# Altium project PCB.PrjPcb
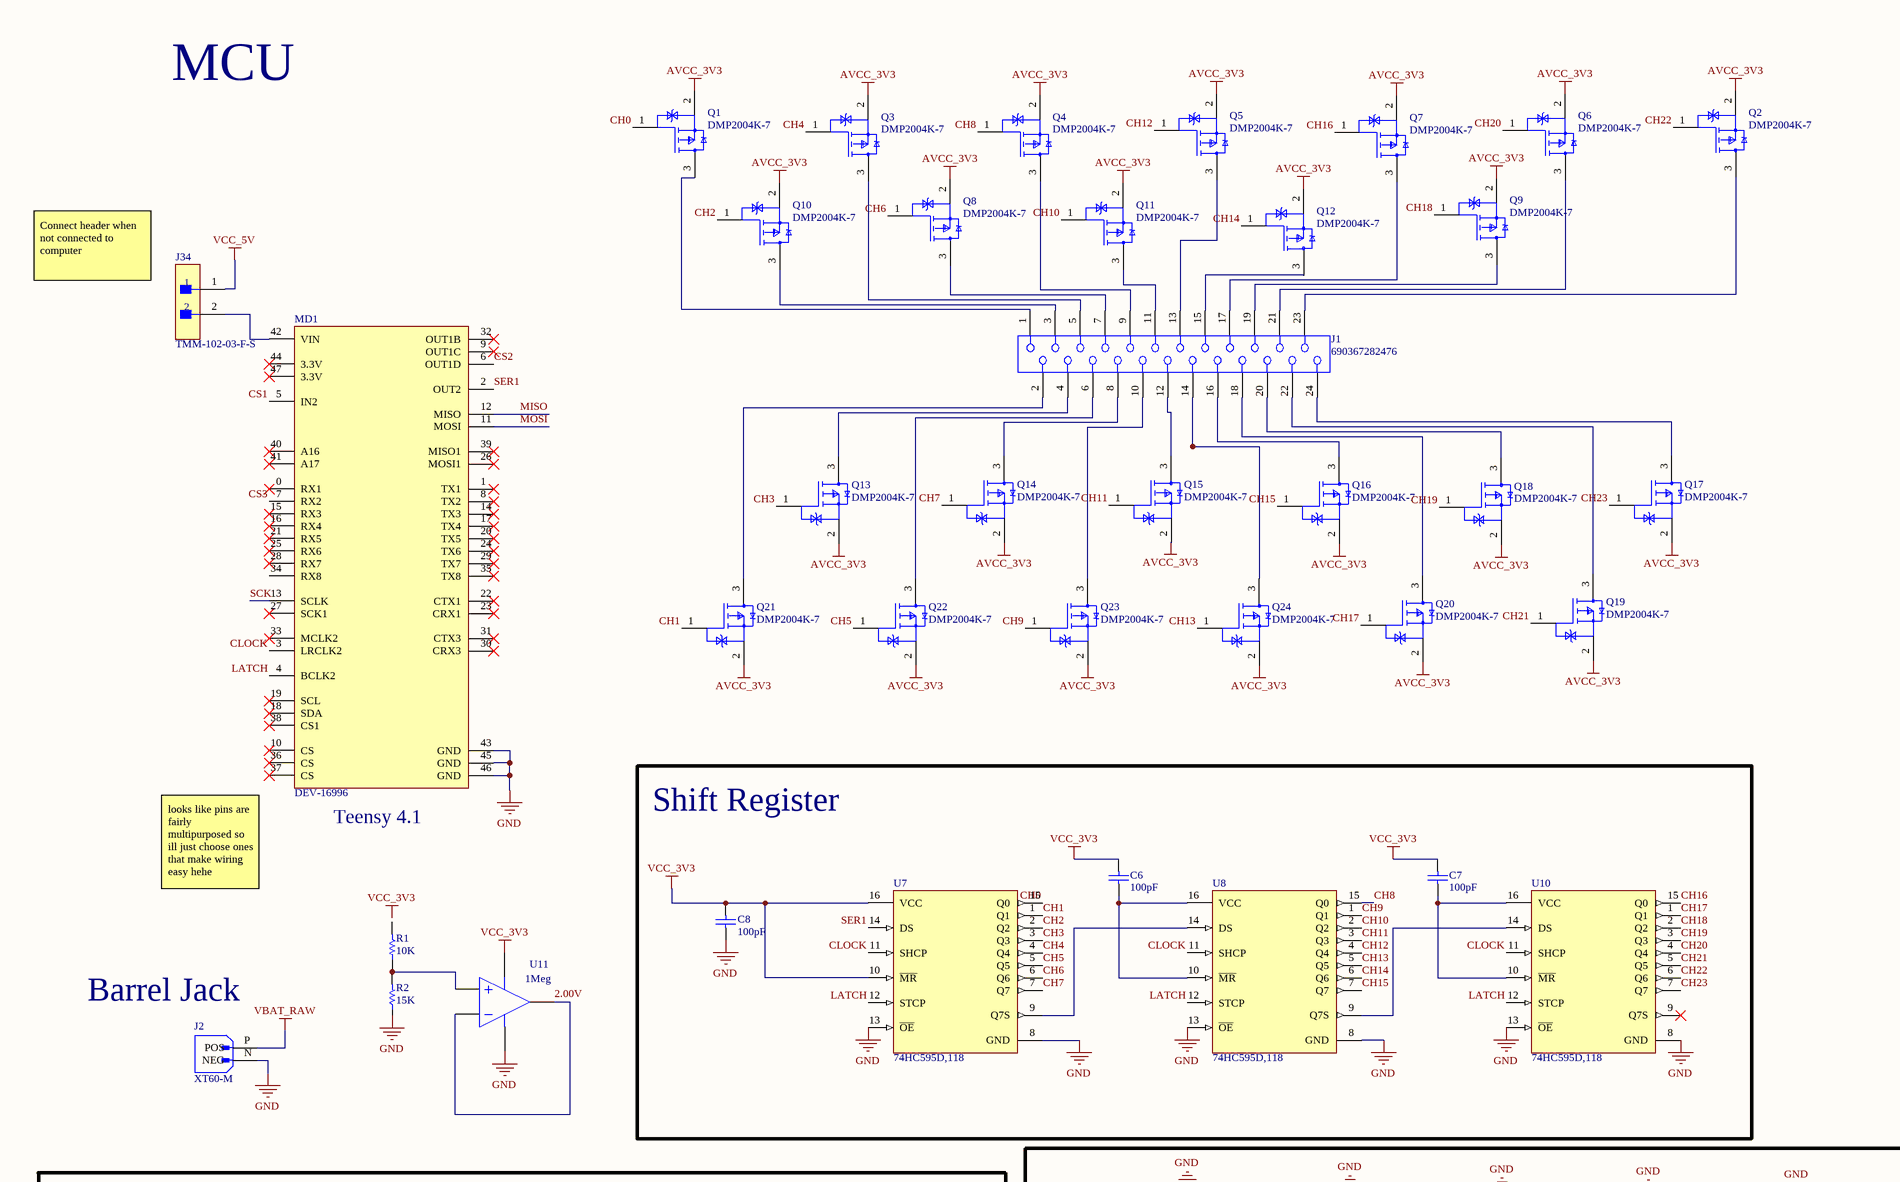
[diagram p0: Schematic.SchDoc, top left]
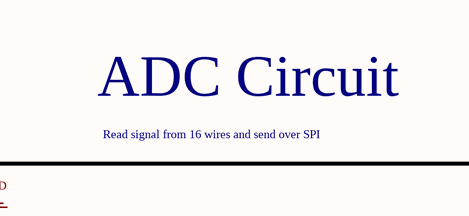
[diagram p1: Schematic.SchDoc, top right]
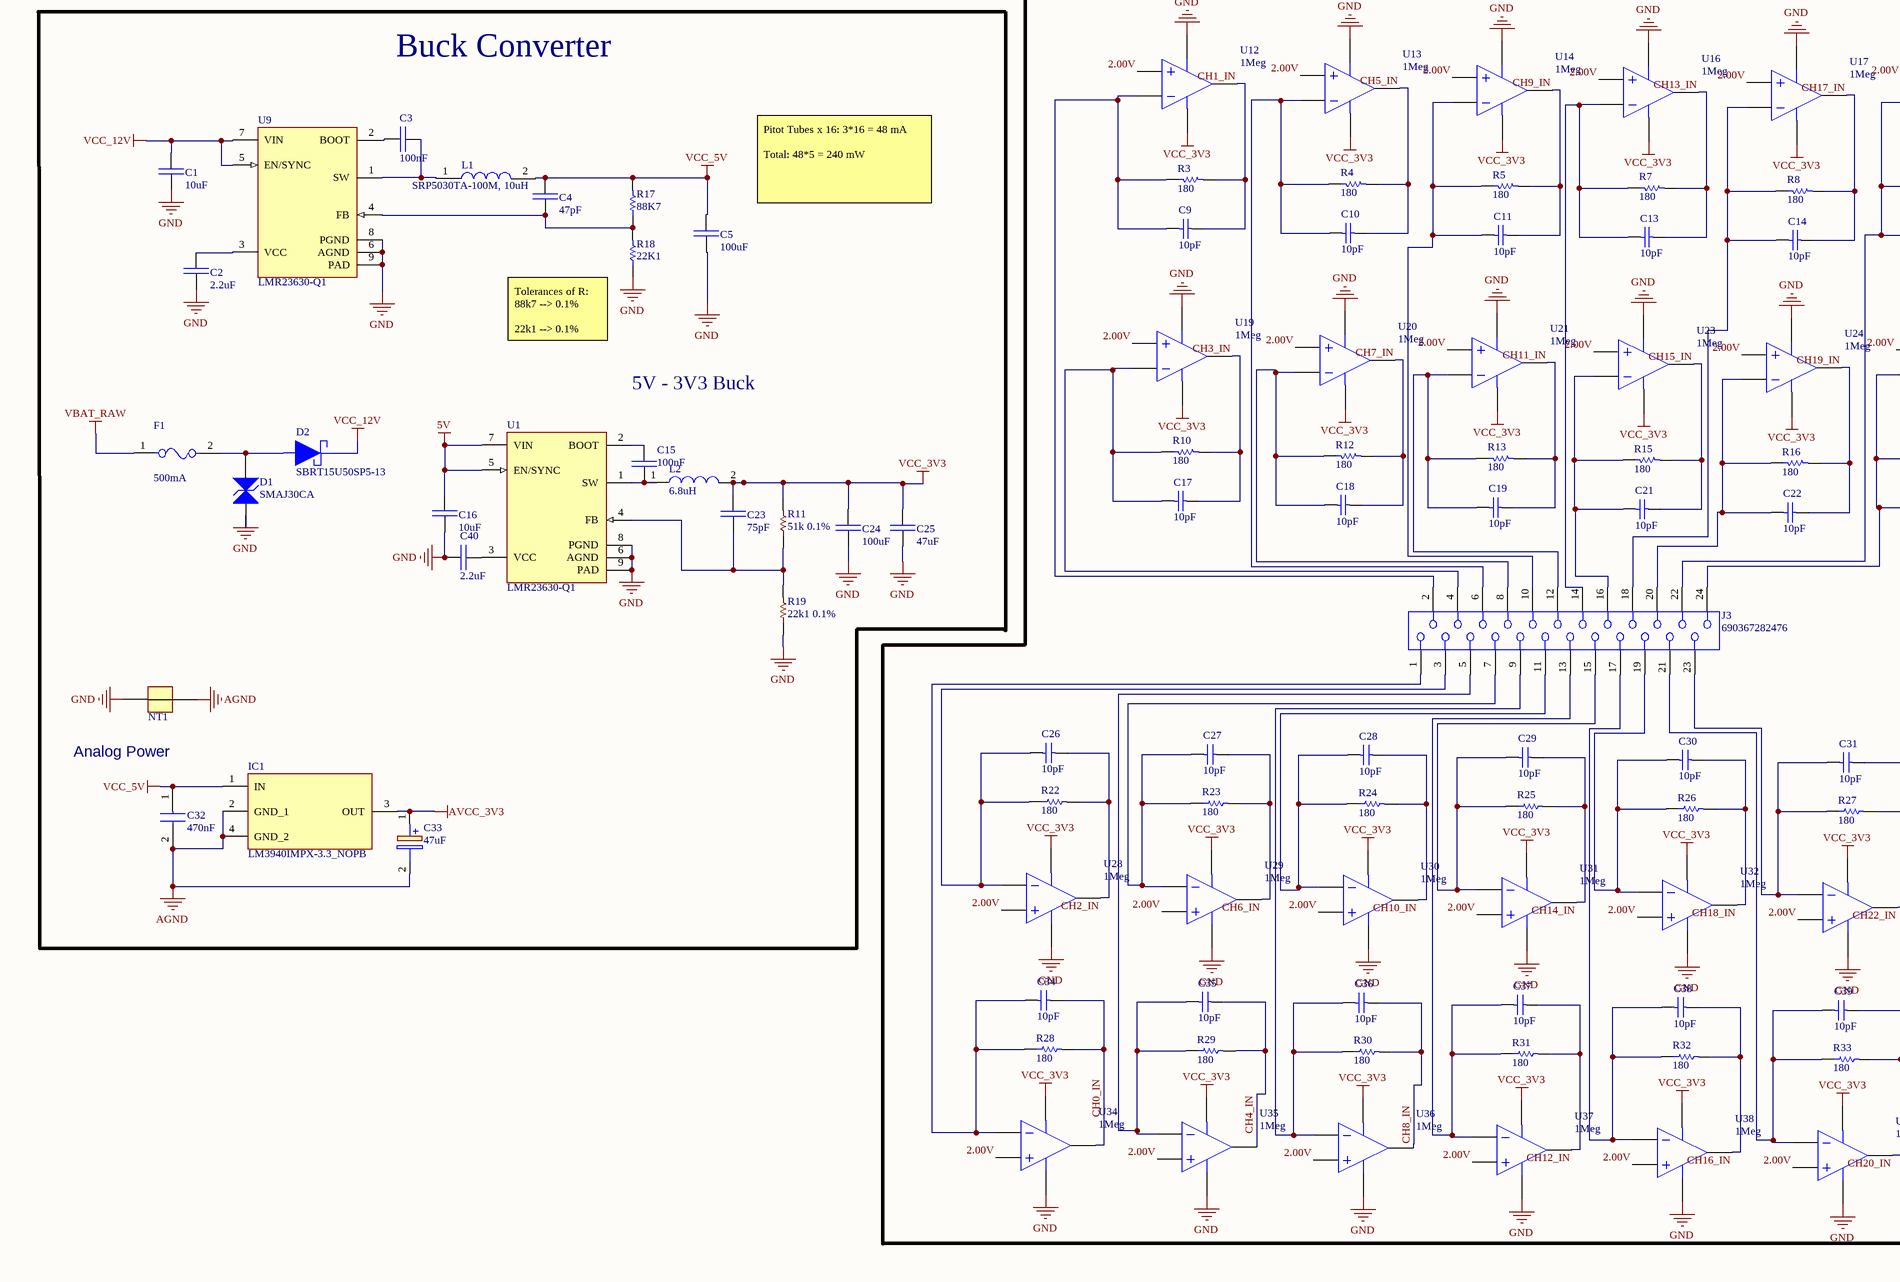
[diagram p2: Schematic.SchDoc, bottom left]
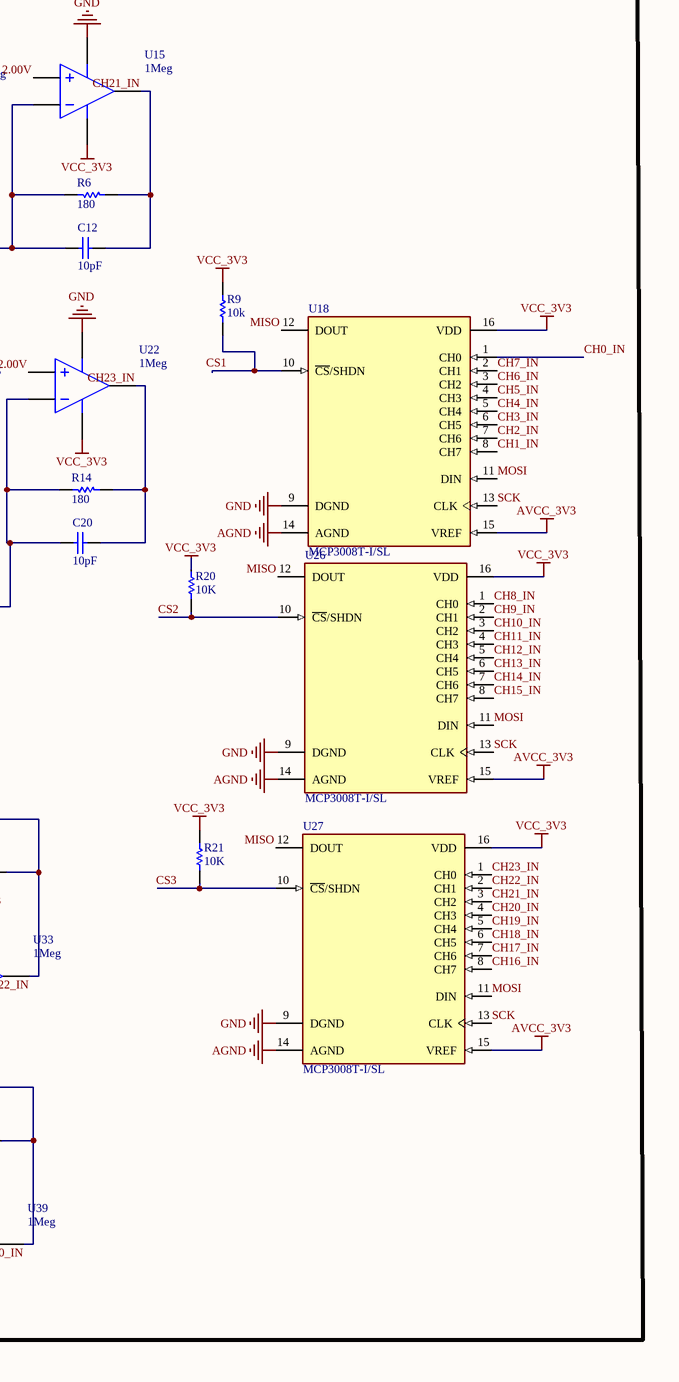
[diagram p3: Schematic.SchDoc, bottom right]
1 sheet, 142 parts. Net scope: global (net labels, ports and power ports of the same name join across sheets).
Board file: PCB.PcbDoc

## Sheet Schematic.SchDoc
size D; SheetNumber: 1; SheetTotal: 1

### Parts
C1  10uF  [CAP_SM0603_YAGEOCC2_N]
C2  2.2uF  [CAP_SM0603_YAGEOCC2_N]
C3  100nF  [CAP_SM0603_YAGEOCC2_N]
C4  47pF  [CAP_SM0603_YAGEOCC2_N]
C5  100uF  [FP-GRM31C-0_3-e0_3_0_8-IPC_A]
C6  100pF  [CAPC2013X140X50LL20T25]
C7  100pF  [CAPC2013X140X50LL20T25]
C8  100pF  [CAPC2013X140X50LL20T25]
C9  value 10pF  [CAP_R15_JOD]  (hidden comment: Capacitor)
C10  value 10pF  [CAP_R15_JOD]  (hidden comment: Capacitor)
C11  value 10pF  [CAP_R15_JOD]  (hidden comment: Capacitor)
C12  value 10pF  [CAP_R15_JOD]  (hidden comment: Capacitor)
C13  value 10pF  [CAP_R15_JOD]  (hidden comment: Capacitor)
C14  value 10pF  [CAP_R15_JOD]  (hidden comment: Capacitor)
C15  100nF  [CAP_SM0603_YAGEOCC2_N]
C16  10uF  [CAP_SM0603_YAGEOCC2_N]
C17  value 10pF  [CAP_R15_JOD]  (hidden comment: Capacitor)
C18  value 10pF  [CAP_R15_JOD]  (hidden comment: Capacitor)
C19  value 10pF  [CAP_R15_JOD]  (hidden comment: Capacitor)
C20  value 10pF  [CAP_R15_JOD]  (hidden comment: Capacitor)
C21  value 10pF  [CAP_R15_JOD]  (hidden comment: Capacitor)
C22  value 10pF  [CAP_R15_JOD]  (hidden comment: Capacitor)
C23  75pF  [CAP_SM0603_YAGEOCC2_N]
C24  100uF  [FP-GRM31C-0_3-e0_3_0_8-IPC_A]
C25  47uF  [CAP_SM0603_YAGEOCC2_N]
C26  value 10pF  [CAP_R15_JOD]  (hidden comment: Capacitor)
C27  value 10pF  [CAP_R15_JOD]  (hidden comment: Capacitor)
C28  value 10pF  [CAP_R15_JOD]  (hidden comment: Capacitor)
C29  value 10pF  [CAP_R15_JOD]  (hidden comment: Capacitor)
C30  value 10pF  [CAP_R15_JOD]  (hidden comment: Capacitor)
C31  value 10pF  [CAP_R15_JOD]  (hidden comment: Capacitor)
C32  470nF  [CAPC1608X90N]
C33  47uF  [CAPPM3216X180N]
C34  value 10pF  [CAP_R15_JOD]  (hidden comment: Capacitor)
C35  value 10pF  [CAP_R15_JOD]  (hidden comment: Capacitor)
C36  value 10pF  [CAP_R15_JOD]  (hidden comment: Capacitor)
C37  value 10pF  [CAP_R15_JOD]  (hidden comment: Capacitor)
C38  value 10pF  [CAP_R15_JOD]  (hidden comment: Capacitor)
C39  value 10pF  [CAP_R15_JOD]  (hidden comment: Capacitor)
C40  2.2uF  [CAP_SM0603_YAGEOCC2_N]
D1  SMAJ30CA  [LFUS-DO-214AC-A-2_V]
D2  SBRT15U50SP5-13  [SBRT15U50SP5-13]
F1  500mA  [FP-SF-0603S-MFG]
IC1  LM3940IMPX-3.3_NOPB  [SOT230P700X180-4N]
J1  690367282476  [FPC-SMD_24P-P0.50_05A20L24P]
J2  XT60-M  [AMASS_XT60-M]
J3  690367282476  [FPC-SMD_24P-P0.50_05A20L24P]
J34  TMM-102-03-F-S  [FP-TMM-102-03-F-S-MFG]
L1  SRP5030TA-100M, 10uH  [INDPM5752X300N]
L2  6.8uH  [INDPM5752X300N]
MD1  DEV-16996  [FP-DEV-16996-MFG]
NT1  Net Tie  [Net_Tie_80mil]  (value not drawn)  (net tie, no BOM)
Q1  DMP2004K-7  [FP-SOT23-MFG]
Q2  DMP2004K-7  [FP-SOT23-MFG]
Q3  DMP2004K-7  [FP-SOT23-MFG]
Q4  DMP2004K-7  [FP-SOT23-MFG]
Q5  DMP2004K-7  [FP-SOT23-MFG]
Q6  DMP2004K-7  [FP-SOT23-MFG]
Q7  DMP2004K-7  [FP-SOT23-MFG]
Q8  DMP2004K-7  [FP-SOT23-MFG]
Q9  DMP2004K-7  [FP-SOT23-MFG]
Q10  DMP2004K-7  [FP-SOT23-MFG]
Q11  DMP2004K-7  [FP-SOT23-MFG]
Q12  DMP2004K-7  [FP-SOT23-MFG]
Q13  DMP2004K-7  [FP-SOT23-MFG]
Q14  DMP2004K-7  [FP-SOT23-MFG]
Q15  DMP2004K-7  [FP-SOT23-MFG]
Q16  DMP2004K-7  [FP-SOT23-MFG]
Q17  DMP2004K-7  [FP-SOT23-MFG]
Q18  DMP2004K-7  [FP-SOT23-MFG]
Q19  DMP2004K-7  [FP-SOT23-MFG]
Q20  DMP2004K-7  [FP-SOT23-MFG]
Q21  DMP2004K-7  [FP-SOT23-MFG]
Q22  DMP2004K-7  [FP-SOT23-MFG]
Q23  DMP2004K-7  [FP-SOT23-MFG]
Q24  DMP2004K-7  [FP-SOT23-MFG]
R1  value 10K  [CAP_R15_JOD]  (hidden comment: Resistor)
R2  value 15K  [CAP_R15_JOD]  (hidden comment: Resistor)
R3  value 180  [CAP_R15_JOD]  (hidden comment: Resistor)
R4  value 180  [CAP_R15_JOD]  (hidden comment: Resistor)
R5  value 180  [CAP_R15_JOD]  (hidden comment: Resistor)
R6  value 180  [CAP_R15_JOD]  (hidden comment: Resistor)
R7  value 180  [CAP_R15_JOD]  (hidden comment: Resistor)
R8  value 180  [CAP_R15_JOD]  (hidden comment: Resistor)
R9  value 10k  [CAP_R15_JOD]  (hidden comment: Resistor)
R10  value 180  [CAP_R15_JOD]  (hidden comment: Resistor)
R11  51k 0.1%  [RES_SM0603_YAGEORC_N]
R12  value 180  [CAP_R15_JOD]  (hidden comment: Resistor)
R13  value 180  [CAP_R15_JOD]  (hidden comment: Resistor)
R14  value 180  [CAP_R15_JOD]  (hidden comment: Resistor)
R15  value 180  [CAP_R15_JOD]  (hidden comment: Resistor)
R16  value 180  [CAP_R15_JOD]  (hidden comment: Resistor)
R17  88K7  [RES_SM0603_YAGEORC_N]
R18  22K1  [RES_SM0603_YAGEORC_N]
R19  22k1 0.1%  [RES_SM0603_YAGEORC_N]
R20  value 10K  [CAP_R15_JOD]  (hidden comment: Resistor)
R21  value 10K  [CAP_R15_JOD]  (hidden comment: Resistor)
R22  value 180  [CAP_R15_JOD]  (hidden comment: Resistor)
R23  value 180  [CAP_R15_JOD]  (hidden comment: Resistor)
R24  value 180  [CAP_R15_JOD]  (hidden comment: Resistor)
R25  value 180  [CAP_R15_JOD]  (hidden comment: Resistor)
R26  value 180  [CAP_R15_JOD]  (hidden comment: Resistor)
R27  value 180  [CAP_R15_JOD]  (hidden comment: Resistor)
R28  value 180  [CAP_R15_JOD]  (hidden comment: Resistor)
R29  value 180  [CAP_R15_JOD]  (hidden comment: Resistor)
R30  value 180  [CAP_R15_JOD]  (hidden comment: Resistor)
R31  value 180  [CAP_R15_JOD]  (hidden comment: Resistor)
R32  value 180  [CAP_R15_JOD]  (hidden comment: Resistor)
R33  value 180  [CAP_R15_JOD]  (hidden comment: Resistor)
U1  LMR23630-Q1  [DDA0008E_N]
U7  74HC595D,118  [FP-SOT109-1-IPC_C]
U8  74HC595D,118  [FP-SOT109-1-IPC_C]
U9  LMR23630-Q1  [DDA0008E_N]
U10  74HC595D,118  [FP-SOT109-1-IPC_C]
U11  GAIN: 1Meg  [DCK0005A-IPC_B]  (hidden comment: Ideal Operational Amplifier)
U12  GAIN: 1Meg  [DCK0005A-IPC_B]  (hidden comment: Ideal Operational Amplifier)
U13  GAIN: 1Meg  [DCK0005A-IPC_B]  (hidden comment: Ideal Operational Amplifier)
U14  GAIN: 1Meg  [DCK0005A-IPC_B]  (hidden comment: Ideal Operational Amplifier)
U15  GAIN: 1Meg  [DCK0005A-IPC_B]  (hidden comment: Ideal Operational Amplifier)
U16  GAIN: 1Meg  [DCK0005A-IPC_B]  (hidden comment: Ideal Operational Amplifier)
U17  GAIN: 1Meg  [DCK0005A-IPC_B]  (hidden comment: Ideal Operational Amplifier)
U18  MCP3008T-I/SL  [FP-C04-108-MFG]
U19  GAIN: 1Meg  [DCK0005A-IPC_B]  (hidden comment: Ideal Operational Amplifier)
U20  GAIN: 1Meg  [DCK0005A-IPC_B]  (hidden comment: Ideal Operational Amplifier)
U21  GAIN: 1Meg  [DCK0005A-IPC_B]  (hidden comment: Ideal Operational Amplifier)
U22  GAIN: 1Meg  [DCK0005A-IPC_B]  (hidden comment: Ideal Operational Amplifier)
U23  GAIN: 1Meg  [DCK0005A-IPC_B]  (hidden comment: Ideal Operational Amplifier)
U24  GAIN: 1Meg  [DCK0005A-IPC_B]  (hidden comment: Ideal Operational Amplifier)
U26  MCP3008T-I/SL  [FP-C04-108-MFG]
U27  MCP3008T-I/SL  [FP-C04-108-MFG]
U28  GAIN: 1Meg  [DCK0005A-IPC_B]  (hidden comment: Ideal Operational Amplifier)
U29  GAIN: 1Meg  [DCK0005A-IPC_B]  (hidden comment: Ideal Operational Amplifier)
U30  GAIN: 1Meg  [DCK0005A-IPC_B]  (hidden comment: Ideal Operational Amplifier)
U31  GAIN: 1Meg  [DCK0005A-IPC_B]  (hidden comment: Ideal Operational Amplifier)
U32  GAIN: 1Meg  [DCK0005A-IPC_B]  (hidden comment: Ideal Operational Amplifier)
U33  GAIN: 1Meg  [DCK0005A-IPC_B]  (hidden comment: Ideal Operational Amplifier)
U34  GAIN: 1Meg  [DCK0005A-IPC_B]  (hidden comment: Ideal Operational Amplifier)
U35  GAIN: 1Meg  [DCK0005A-IPC_B]  (hidden comment: Ideal Operational Amplifier)
U36  GAIN: 1Meg  [DCK0005A-IPC_B]  (hidden comment: Ideal Operational Amplifier)
U37  GAIN: 1Meg  [DCK0005A-IPC_B]  (hidden comment: Ideal Operational Amplifier)
U38  GAIN: 1Meg  [DCK0005A-IPC_B]  (hidden comment: Ideal Operational Amplifier)
U39  GAIN: 1Meg  [DCK0005A-IPC_B]  (hidden comment: Ideal Operational Amplifier)

### Blocks framed on the sheet
Shift Register: C6-C8 U7 U8 U10

### Nets
5V: C16.1 U1.5(EN/SYNC) U1.7(VIN)
AGND: C32.2 C33.2(-) IC1.2(GND_1) IC1.4(GND_2) NT1.2 U18.14(AGND) U26.14(AGND) U27.14(AGND)
AVCC_3V3: C33.1(+) IC1.3(OUT) Q1.2(S) Q2.2(S) Q3.2(S) Q4.2(S) Q5.2(S) Q6.2(S) Q7.2(S) Q8.2(S) Q9.2(S) Q10.2(S) Q11.2(S) Q12.2(S) Q13.2(S) Q14.2(S) Q15.2(S) Q16.2(S) Q17.2(S) Q18.2(S) Q19.2(S) Q20.2(S) Q21.2(S) Q22.2(S) Q23.2(S) Q24.2(S) U18.15(VREF) U26.15(VREF) U27.15(VREF)
GND: C1.2 C2.2 C5.2 C8.1 C16.2 C24.2 C25.2 C40.1 D1.1(A) J2.N(NEG) MD1.43(GND) MD1.45(GND) MD1.46(GND) NT1.1 R18.1 R19.1 U1.6(AGND) U1.8(PGND) U1.9(PAD) U7.8(GND) U7.13(~{OE}) U8.8(GND) U8.13(~{OE}) U9.6(AGND) U9.8(PGND) U9.9(PAD) U10.8(GND) U10.13(~{OE}) U11.4(V+) U12.5(V-) U13.5(V-) U14.5(V-) U15.5(V-) U16.5(V-) U17.5(V-) U18.9(DGND) U19.5(V-) U20.5(V-) U21.5(V-) U22.5(V-) U23.5(V-) U24.5(V-) U26.9(DGND) U27.9(DGND) U28.5(V-) U29.5(V-) U30.5(V-) U31.5(V-) U32.5(V-) U33.5(V-) U34.5(V-) U35.5(V-) U36.5(V-) U37.5(V-) U38.5(V-) U39.5(V-)
VBAT_RAW: F1.1 J2.P(POS)
VCC_3V3: C6.2 C7.2 C8.2 C23.1 C24.1 C25.1 L2.2 R9.2 R11.2 R20.2 R21.2 U7.10(~{MR}) U7.16(VCC) U11.5(V-) U12.4(V+) U13.4(V+) U14.4(V+) U15.4(V+) U16.4(V+) U17.4(V+) U18.16(VDD) U19.4(V+) U20.4(V+) U21.4(V+) U22.4(V+) U23.4(V+) U24.4(V+) U26.16(VDD) U27.16(VDD) U28.4(V+) U29.4(V+) U30.4(V+) U31.4(V+) U32.4(V+) U33.4(V+) U34.4(V+) U35.4(V+) U36.4(V+) U37.4(V+) U38.4(V+) U39.4(V+)
VCC_5V: C4.1 C5.1 C32.1 IC1.1(IN) J34.1 L1.2 R17.2
VCC_12V: C1.1 D2.2 U9.5(EN/SYNC) U9.7(VIN)
2.00V: U12.2(IN+) U13.2(IN+) U14.2(IN+) U15.2(IN+) U16.2(IN+) U17.2(IN+) U19.2(IN+) U20.2(IN+) U21.2(IN+) U22.2(IN+) U23.2(IN+) U24.2(IN+) U28.2(IN+) U29.2(IN+) U30.2(IN+) U31.2(IN+) U32.2(IN+) U33.2(IN+) U34.2(IN+) U35.2(IN+) U36.2(IN+) U37.2(IN+) U38.2(IN+) U39.2(IN+)
CH0: Q1.1(G) U7.15(Q0)
CH0_IN: C34.2 R28.2 U18.1(CH0) U34.3(OUT)
CH1: Q21.1(G) U7.1(Q1)
CH1_IN: C9.2 R3.2 U12.3(OUT) U18.8(CH7)
CH2: Q10.1(G) U7.2(Q2)
CH2_IN: C26.2 R22.2 U18.7(CH6) U28.3(OUT)
CH3: Q13.1(G) U7.3(Q3)
CH3_IN: C17.2 R10.2 U18.6(CH5) U19.3(OUT)
CH4: Q3.1(G) U7.4(Q4)
CH4_IN: C35.2 R29.2 U18.5(CH4) U35.3(OUT)
CH5: Q22.1(G) U7.5(Q5)
CH5_IN: C10.2 R4.2 U13.3(OUT) U18.4(CH3)
CH6: Q8.1(G) U7.6(Q6)
CH6_IN: C27.2 R23.2 U18.3(CH2) U29.3(OUT)
CH7: Q14.1(G) U7.7(Q7)
CH7_IN: C18.2 R12.2 U18.2(CH1) U20.3(OUT)
CH8: Q4.1(G) U8.15(Q0)
CH8_IN: C36.2 R30.2 U26.1(CH0) U36.3(OUT)
CH9: Q23.1(G) U8.1(Q1)
CH9_IN: C11.2 R5.2 U14.3(OUT) U26.2(CH1)
CH10: Q11.1(G) U8.2(Q2)
CH10_IN: C28.2 R24.2 U26.3(CH2) U30.3(OUT)
CH11: Q15.1(G) U8.3(Q3)
CH11_IN: C19.2 R13.2 U21.3(OUT) U26.4(CH3)
CH12: Q5.1(G) U8.4(Q4)
CH12_IN: C37.2 R31.2 U26.5(CH4) U37.3(OUT)
CH13: Q24.1(G) U8.5(Q5)
CH13_IN: C13.2 R7.2 U16.3(OUT) U26.6(CH5)
CH14: Q12.1(G) U8.6(Q6)
CH14_IN: C29.2 R25.2 U26.7(CH6) U31.3(OUT)
CH15: Q16.1(G) U8.7(Q7)
CH15_IN: C21.2 R15.2 U23.3(OUT) U26.8(CH7)
CH16: Q7.1(G) U10.15(Q0)
CH16_IN: C38.2 R32.2 U27.8(CH7) U38.3(OUT)
CH17: Q20.1(G) U10.1(Q1)
CH17_IN: C14.2 R8.2 U17.3(OUT) U27.7(CH6)
CH18: Q9.1(G) U10.2(Q2)
CH18_IN: C30.2 R26.2 U27.6(CH5) U32.3(OUT)
CH19: Q18.1(G) U10.3(Q3)
CH19_IN: C22.2 R16.2 U24.3(OUT) U27.5(CH4)
CH20: Q6.1(G) U10.4(Q4)
CH20_IN: C39.2 R33.2 U27.4(CH3) U39.3(OUT)
CH21: Q19.1(G) U10.5(Q5)
CH21_IN: C12.2 R6.2 U15.3(OUT) U27.3(CH2)
CH22: Q2.1(G) U10.6(Q6)
CH22_IN: C31.2 R27.2 U27.2(CH1) U33.3(OUT)
CH23: Q17.1(G) U10.7(Q7)
CH23_IN: C20.2 R14.2 U22.3(OUT) U27.1(CH0)
CLOCK: MD1.3(LRCLK2) U7.11(SHCP) U8.11(SHCP) U10.11(SHCP)
CS1: MD1.5(IN2) R9.1 U18.10(~{CS}/SHDN)
CS2: MD1.6(OUT1D) R20.1 U26.10(~{CS}/SHDN)
CS3: MD1.7(RX2) R21.1 U27.10(~{CS}/SHDN)
LATCH: MD1.4(BCLK2) U7.12(STCP) U8.12(STCP) U10.12(STCP)
MISO: MD1.12(MISO) U18.12(DOUT) U26.12(DOUT) U27.12(DOUT)
MOSI: MD1.11(MOSI) U18.11(DIN) U26.11(DIN) U27.11(DIN)
SCK: MD1.13(SCLK) U18.13(CLK) U26.13(CLK) U27.13(CLK)
SER1: MD1.2(OUT2) U7.14(DS)
NetC2_1: C2.1 U9.3(VCC)
NetC3_1: C3.1 U9.2(BOOT)
NetC3_2: C3.2 L1.1 U9.1(SW)
NetC4_2: C4.2 R17.1 R18.2 U9.4(FB)
NetC6_1: C6.1 U8.10(~{MR}) U8.16(VCC)
NetC7_1: C7.1 U10.10(~{MR}) U10.16(VCC)
NetC9_1: C9.1 J3.2 R3.1 U12.1(IN-)
NetC10_1: C10.1 J3.6 R4.1 U13.1(IN-)
NetC11_1: C11.1 J3.10 R5.1 U14.1(IN-)
NetC12_1: C12.1 J3.22 R6.1 U15.1(IN-)
NetC13_1: C13.1 J3.14 R7.1 U16.1(IN-)
NetC14_1: C14.1 J3.18 R8.1 U17.1(IN-)
NetC15_1: C15.1 U1.2(BOOT)
NetC15_2: C15.2 L2.1 U1.1(SW)
NetC17_1: C17.1 J3.4 R10.1 U19.1(IN-)
NetC18_1: C18.1 J3.8 R12.1 U20.1(IN-)
NetC19_1: C19.1 J3.12 R13.1 U21.1(IN-)
NetC20_1: C20.1 J3.24 R14.1 U22.1(IN-)
NetC21_1: C21.1 J3.16 R15.1 U23.1(IN-)
NetC22_1: C22.1 J3.20 R16.1 U24.1(IN-)
NetC23_2: C23.2 R11.1 R19.2 U1.4(FB)
NetC26_1: C26.1 J3.3 R22.1 U28.1(IN-)
NetC27_1: C27.1 J3.7 R23.1 U29.1(IN-)
NetC28_1: C28.1 J3.11 R24.1 U30.1(IN-)
NetC29_1: C29.1 J3.15 R25.1 U31.1(IN-)
NetC30_1: C30.1 J3.19 R26.1 U32.1(IN-)
NetC31_1: C31.1 J3.23 R27.1 U33.1(IN-)
NetC34_1: C34.1 J3.1 R28.1 U34.1(IN-)
NetC35_1: C35.1 J3.5 R29.1 U35.1(IN-)
NetC36_1: C36.1 J3.9 R30.1 U36.1(IN-)
NetC37_1: C37.1 J3.13 R31.1 U37.1(IN-)
NetC38_1: C38.1 J3.17 R32.1 U38.1(IN-)
NetC39_1: C39.1 J3.21 R33.1 U39.1(IN-)
NetC40_2: C40.2 U1.3(VCC)
NetD1_2: D1.2(A) D2.1 F1.2
NetJ1_1: J1.1 Q1.3(D)
NetJ1_2: J1.2 Q21.3(D)
NetJ1_3: J1.3 Q10.3(D)
NetJ1_4: J1.4 Q13.3(D)
NetJ1_5: J1.5 Q3.3(D)
NetJ1_6: J1.6 Q22.3(D)
NetJ1_7: J1.7 Q8.3(D)
NetJ1_8: J1.8 Q14.3(D)
NetJ1_9: J1.9 Q4.3(D)
NetJ1_10: J1.10 Q23.3(D)
NetJ1_11: J1.11 Q11.3(D)
NetJ1_12: J1.12 Q15.3(D)
NetJ1_13: J1.13 Q5.3(D)
NetJ1_14: J1.14 Q24.3(D)
NetJ1_15: J1.15 Q12.3(D)
NetJ1_16: J1.16 Q16.3(D)
NetJ1_17: J1.17 Q7.3(D)
NetJ1_18: J1.18 Q20.3(D)
NetJ1_19: J1.19 Q9.3(D)
NetJ1_20: J1.20 Q18.3(D)
NetJ1_21: J1.21 Q6.3(D)
NetJ1_22: J1.22 Q19.3(D)
NetJ1_23: J1.23 Q2.3(D)
NetJ1_24: J1.24 Q17.3(D)
NetJ34_2: J34.2 MD1.42(VIN)
NetR1_1: R1.1 R2.2 U11.2(IN+)
NetU7_9: U7.9(Q7S) U8.14(DS)
NetU8_9: U8.9(Q7S) U10.14(DS)
NetU11_1: U11.1(IN-) U11.3(OUT)

Not connected (* = marked no-connect by the designer): MD1 0(RX1)* 1(TX1)* 8(TX2)* 9(OUT1C)* 10(CS)* 14(TX3)* 15(RX3)* 16(RX4)* 17(TX4)* 18(SDA)* 19(SCL)* 20(TX5)* 21(RX5)* 22(CTX1)* 23(CRX1)* 24(TX6)* 25(RX6)* 26(MOSI1)* 27(SCK1)* 28(RX7)* 29(TX7)* 30(CRX3)* 31(CTX3)* 32(OUT1B)* 33(MCLK2)* 34(RX8) 35(TX8)* 36(CS)* 37(CS)* 38(CS1)* 39(MISO1)* 40(A16)* 41(A17)* 44(3.3V)* 47(3.3V)*; R1 2; R2 1; U10 9(Q7S)*

### Notes on the sheet
- MCU
- (near J34) Connect header when not connected to computer
- (near MD1) Teensy 4.1
- (near MD1) looks like pins are fairly multipurposed so ill just choose ones that make wiring easy hehe
- (near J2) Barrel Jack
- ADC Circuit
- Read signal from 16 wires and send over SPI
- Buck Converter
- Pitot Tubes x 16: 3*16 = 48 mA
  Total: 48*5 = 240 mW
- (near R18) Tolerances of R:
  88k7 --> 0.1%
  22k1 --> 0.1%
- 5V - 3V3 Buck
- Analog Power
- Labels drawn without touching a wire or pin: 2.00V, GND, VCC_3V3

### Library data of the parts
C1 C16 = GRM188R6YA106MA73D: Ceramic Capacitor, Multilayer, Ceramic, 35V, 20% +Tol, 20% -Tol, X5R, 15% TC, 10uF, Surface Mount, 0603; Manufacturer: Murata; Multilayer: Yes; Supplier: Arrow Electronics; Supplier Part Number: GRM188R6YA106MA73D; Manufacturer Part Number: GRM188R6YA106MA73D; RoHS: Yes; Category: Ceramic Capacitors; Stock: 56000; Pricing: 4000=0.0516, 8000=0.043, 24000=0.0355 (USD); Mounting Technology: Surface Mount; Pins: 2; Dielectric Material: Ceramic; Package Shape: Rectangular; Case/Package: 0603; Terminal Finish: Nickel; Min Operating Temperature: -55°C; Max Operating Temperature: 85°C; JESD-609 Code: e3; Value: 10uF; Capacitor Type: Ceramic; Tolerance  (fill in as +-): 20%; Packaging: Tape and Reel; Tolerance (fill in as +-): 20%; Rated DC Voltage (URdc): 35V; Temperature Characteristics Code: X5R; Termination: Wraparound; Reach SVHC Compliant: Yes; RoHS Compliant: Yes; ComponentLink1URL: https://datasheet.ciiva.com:443/pdfs/VipMasterIC/IC/MURE/MURE-S-A0004349797/MURE-S-A0004352457-1.pdf?src-supplier=IHS+Markit; ComponentLink1Description: https://datasheet.ciiva.com:443/pdfs/VipMasterIC/IC/MURE/MURE-S-A0004349797/MURE-S-A0004352457-1.pdf?src-supplier=IHS+Markit; ComponentLink2URL: http://search.murata.co.jp/Ceramy/image/img/A01X/G101/ENG/GRM188R6YA106MA73-01.pdf?src-supplier=Digikey; ComponentLink2Description: http://search.murata.co.jp/Ceramy/image/img/A01X/G101/ENG/GRM188R6YA106MA73-01.pdf?src-supplier=Digikey; ComponentLink3URL: https://www.murata.com/~/media/webrenewal/support/library/catalog/products/capacitor/mlcc/c02e.ashx?la=en-us&src-supplier=Digikey; ComponentLink3Description: https://www.murata.com/~/media/webrenewal/support/library/catalog/products/capacitor/mlcc/c02e.ashx?la=en-us&src-supplier=Digikey; ComponentLink4URL: https://datasheet.octopart.com/GRM188R6YA106MA73D-Murata-datasheet-149523261.pdf?src-supplier=Newark; ComponentLink4Description: https://datasheet.octopart.com/GRM188R6YA106MA73D-Murata-datasheet-149523261.pdf?src-supplier=Newark; ComponentLink5URL: https://datasheet.octopart.com/GRM188R6YA106MA73D-Murata-datasheet-86813743.pdf?src-supplier=Future+Electronics; ComponentLink5Description: https://datasheet.octopart.com/GRM188R6YA106MA73D-Murata-datasheet-86813743.pdf?src-supplier=Future+Electronics; ComponentLink6URL: http://search.murata.co.jp/Ceramy/image/img/A01X/G101/ENG/GRM188R6YA106MA73-01.pdf?src-supplier=Future+Electronics; ComponentLink6Description: http://search.murata.co.jp/Ceramy/image/img/A01X/G101/ENG/GRM188R6YA106MA73-01.pdf?src-supplier=Future+Electronics; ComponentLink7URL: http://search.murata.co.jp/Ceramy/image/img/A01X/G101/ENG/GRM188R6YA106MA73-01.pdf?src-supplier=Mouser; ComponentLink7Description: http://search.murata.co.jp/Ceramy/image/img/A01X/G101/ENG/GRM188R6YA106MA73-01.pdf?src-supplier=Mouser; ComponentLink8URL: http://search.murata.co.jp/Ceramy/image/img/A01X/G101/ENG/GRM188R6YA106MA73-01.pdf?src-supplier=TTI; ComponentLink8Description: http://search.murata.co.jp/Ceramy/image/img/A01X/G101/ENG/GRM188R6YA106MA73-01.pdf?src-supplier=TTI; ComponentLink9URL: https://datasheet.octopart.com/GRM188R6YA106MA73D-Murata-datasheet-165579666.pdf?src-supplier=TME; ComponentLink9Description: https://datasheet.octopart.com/GRM188R6YA106MA73D-Murata-datasheet-165579666.pdf?src-supplier=TME
C2 C40 = CC0603KRX5R8BB225: CAP CER 2.2UF 25V X5R 0603; Manufacturer: Yageo; Manufacturer Part Number: CC0603KRX7R9BB183; Tolerance (%): 10; Voltage Rating (Volts): 50; Category: Capacitor; Package: 0603; Value: 2.2uF; Supplier Part Number 1: 3019743; Supplier 1: Farnell; ComponentLink1URL: http://www.yageo.com; ComponentLink1Description: Manufacturer Website; Supplier 2: Digi-Key
C3 C15 = CC0603KRX7R9BB104: CAP 100nF SM0603 X7R 50V YAGEO CC2; Tolerance (%): 10; Voltage Rating (Volts): 50; Category: Capacitor; Manufacturer: Yageo; Manufacturer Part Number: CC0603KRX7R9BB104; Package: 0603; Value: 100nF; Supplier Part Number 1: 1362556; Supplier 1: Farnell; ComponentLink1URL: http://www.yageo.com; ComponentLink1Description: Manufacturer Website; Supplier 2: Digi-Key; Supplier Part Number 2: 311-1344-1-ND
C4 = CC0603JRNPO9BN470: CAP 47pF SM0603 NPO 50V YAGEO CC2; Tolerance (%): 5; Voltage Rating (Volts): 50; Category: Capacitor; Manufacturer: Yageo; Manufacturer Part Number: CC0603JRNPO9BN470; Package: 0603; Value: 47pF; Supplier Part Number 1: 722042; Supplier 1: Farnell; ComponentLink1URL: http://www.yageo.com; ComponentLink1Description: Manufacturer Website; Supplier 2: Digi-Key; Supplier Part Number 2: 311-1065-1-ND
C5 C24 = GRM31CR61A107MEA8L: Ceramic Capacitor, Multilayer, Ceramic, 10V, 20% +Tol, 20% -Tol, X5R, 15% TC, 100uF, Surface Mount, 1206; Manufacturer: Murata; Supplier: Arrow Electronics; Supplier Part Number: GRM31CR61A107MEA8L; Manufacturer Part Number: GRM31CR61A107MEA8L; RoHS: Yes; Category: Ceramic Capacitors; Stock: 6000; Pricing: 2000=0.1239, 10000=0.1122, 50000=0.0993 (USD); RoHS Compliant: Yes; ComponentLink1URL: https://datasheet.octopart.com/GRM31CR61A107MEA8L-Murata-datasheet-165579666.pdf?src-supplier=TME; ComponentLink1Description: https://datasheet.octopart.com/GRM31CR61A107MEA8L-Murata-datasheet-165579666.pdf?src-supplier=TME
  C24: Supplier 1: DigiKey; Supplier Part Number 1: 490-GRM31CR61A107MEA8LCT-ND
C6-C8 = CMP-2007-04674-1: Part Number: 0805ZC105KAZ2A; Manufacturer: AVX Interconnect / Elco
C9-C14 C17-C22 C26-C31 C34-C39 = Capacitor: SimulationGenericComponent: True
C23 = CC0603JRNPO9BN750: CAP 75pF SM0603 NPO 50V YAGEO CC2; Manufacturer Part Number: CC0603JRNPO9BN820; Tolerance (%): 5; Voltage Rating (Volts): 50; Category: Capacitor; Manufacturer: Yageo; Package: 0603; Value: 75pF; Supplier Part Number 1: 722078; Supplier 1: Farnell; ComponentLink1URL: http://www.yageo.com; ComponentLink1Description: Manufacturer Website; Supplier 2: Digi-Key; Supplier Part Number 2: 311-1068-1-ND
C25 = CC0603MRX5R4BB476: CAP 47uF SM0603 X5R 4V YAGEO CC2; Manufacturer Part Number: CC0603KRX7R9BB223; Tolerance (%): 10; Voltage Rating (Volts): 50; Category: Capacitor; Manufacturer: Yageo; Package: 0603; Value: 47uF; Supplier Part Number 1: 3019755; Supplier 1: Farnell; ComponentLink1URL: http://www.yageo.com; ComponentLink1Description: Manufacturer Website; Supplier 2: Digi-Key; Supplier Part Number 2: 311-1370-1-ND
C32 = CGA3E3X7R1H474K080AB: SMD/SMT CGA 0603 50V 0.47uF X7R 10% AEC-Q200; Manufacturer_Name: TDK; Datasheet Link: http://docs-europe.electrocomponents.com/webdocs/14e9/0900766b814e9125.pdf; Height: 0.9mm; Manufacturer_Part_Number: CGA3E3X7R1H474K080AB; Mouser Part Number: 810-CGA3E3X7R1H474KB; Mouser Price/Stock: https://www.mouser.co.uk/ProductDetail/TDK/CGA3E3X7R1H474K080AB?qs=xLDY6iXSiQYK0oGm7fVVjw%3D%3D; Arrow Part Number: CGA3E3X7R1H474K080AB; Arrow Price/Stock: https://www.arrow.com/en/products/cga3e3x7r1h474k080ab/tdk
C33 = TLJA476M010R0600: 47uF 10V Tantalum Capacitor For LM3940IMPX-3.3_NOPB LDO; Manufacturer_Name: Kyocera AVX; Datasheet Link: https://componentsearchengine.com/Datasheets/1/TLJA476M010R0600.pdf; Height: 1.8mm; Manufacturer_Part_Number: TLJA476M010R0600; Mouser Part Number: 581-TLJA476M010R0600; Mouser Price/Stock: https://www.mouser.co.uk/ProductDetail/AVX/TLJA476M010R0600?qs=o28%2FEEzBmj3NNm8C9jVwcw%3D%3D; Arrow Part Number: TLJA476M010R0600; Arrow Price/Stock: https://www.arrow.com/en/products/tlja476m010r0600/avx
D1 = SMAJ30CA: Transient Voltage Suppression Diode, 30 V, -65 to 150 degC, 2-Pin SMD, RoHS, Tape and Reel; Manufacturer: Littelfuse; Current - Peak Pulse (10/1000µs): 8.3A; Power - Peak Pulse: 400W; Voltage - Breakdown (Min): 33.3V; Bidirectional Channels: 1; Power Line Protection: No; Voltage - Clamping (Max) @ Ipp: 48.4V; Voltage - Reverse Standoff (Typ): 30V; Type: Zener; Category: CircuitProtection; Datasheet Version: 11/2015; Package Description: 2-Pin Surface Mount Device, Body 4.295 x 2.595 mm; Family: TVS-Diodes; Manufacturer URL: http://www.littelfuse.com/; Series: SMAJ; Package / Case: DO-214AC,SMA; Capacitance @ Frequency: -; Package Reference: DO-214AC; Packaging: Digi-Reel®; Applications: GeneralPurpose; Mounting Technology: SurfaceMount; Mounting Type: SurfaceMount; Unidirectional Channels: -; Supplier Device Package: DO-214AC(SMA); Operating Temperature: -55°C~150°C(TJ); Datasheet URL: http://www.littelfuse.com/~/media/electronics/datasheets/tvs_diodes/littelfuse_tvs_diode_smaj_datasheet.pdf.pdf; Manufacturer Part Number: SMAJ30CA
D2 = SBRT15U50SP5-13: Reverse Polarity Protection; Manufacturer: Diodes Incorporated; Diode Type: Super Barrier; Current - Average Rectified (Io): 15A; Speed: Fast Recovery =< 500ns, > 200mA (Io); Supplier 1: Digi-Key; Supplier Part Number 1: SBRT15U50SP5-13DICT-ND; Manufacturer Part Number: SBRT15U50SP5-13; RoHS: RoHS Compliant; Category: Discrete Semiconductor Products; Stock 1: 12134; Pricing 1: 1=0.93, 10=0.823, 100=0.6306, 500=0.49852, 1000=0.39882 (USD); Packaging: Cut Tape (CT); Part Status: Active; Capacitance @ Vr, F: -; Mounting Type: Surface Mount; Package / Case: PowerDI™ 5; Supplier Device Package: PowerDI®5; Operating Temperature - Junction: -65°C ~ 150°C; ComponentLink1URL: https://media.digikey.com/pdf/Data%20Sheets/Diodes%20PDFs/SBRT15U50SP5.pdf; ComponentLink1Description: https://media.digikey.com/pdf/Data%20Sheets/Diodes%20PDFs/SBRT15U50SP5.pdf
F1 = CMP-07399-000004-1: FUSE BOARD MNT 500MA 50VDC 0603; Manufacturer: Bourns Inc.; Manufacturer Part Number: SF-0603S050-2; Fuse I2T: 0.009A2Sec; Fuse Current: 0.5A; Fuse Interrupt Ac Current: 50A; Max Fuse Ac Voltage: 35V; Resistance: 232mΩ; Fuse Blow Speed: Slow; Value: 232mΩ; Max Fuse Dc Voltage: 50V; Automotive: No; Category: Fuse; Temperature Range High: +105°C; Device Class L1: Circuit Protection; Height: 0.55mm; RoHS: TRUE; ComponentLink2URL: https://www.bourns.com/docs/product-datasheets/sf0603s.pdf; Ipc Land Pattern Name: CAPC16080X45; Temperature Range Low: -20°C; Mouser Description: Surface Mount Fuses 0.50A Slow Blow SinglFuse; Package: SF-0603S; Device Class L3: unset; Digikey Description: FUSE BOARD MNT 500MA 50VDC 0603; Device Class L2: Fuses; Lead Free: Yes; Temperature: -20°C to +105°C; ComponentLink2Description: Datasheet; Octopart: https://octopart.com/sf-0603s050-2-bourns-10486821; Fuse Interrupt Dc Current: 50A
IC1 = LM3940IMPX-3.3_NOPB: 3V3 LDO; Manufacturer_Name: Texas Instruments; Manufacturer_Part_Number: LM3940IMPX-3.3/NOPB; Datasheet Link: http://www.ti.com/lit/ds/symlink/lm3940.pdf; Height: 1.8mm; Mouser Part Number: 926-LM3940IMPX33NOPB; Mouser Price/Stock: https://www.mouser.co.uk/ProductDetail/Texas-Instruments/LM3940IMPX-3.3-NOPB?qs=QbsRYf82W3FUgXR%252BoLZPCw%3D%3D; Arrow Part Number: LM3940IMPX-3.3/NOPB; Arrow Price/Stock: https://www.arrow.com/en/products/lm3940impx-3.3nopb/texas-instruments?region=nac
J1 J3 = CMP-1502-00827-2: NexarPartId: 65687603; Pitch: 2.54mm; Insulation Resistance: 1GΩ; Contact Resistance: 10mΩ; Operating Supply Voltage: 100V; Gender: Female; Current Rating: 1.5A; Lead Pitch: 2.54mm; Max Operating Temperature: 105°C; RoHS: Compliant; Min Operating Temperature: -40°C; Packaging: Tape and Reel; Number of Pins: 24; Length: 31.01mm
J2 = XT60-M: Plug; DC supply; XT60; male; PIN: 2; for cable; soldered; 30A; 500V; MF: AMASS; SnapEDA_Link: https://www.snapeda.com/parts/XT60-M/AMASS/view-part/?ref=snap; Package: Package; Value: *; MP: XT60-M; Check_prices: https://www.snapeda.com/parts/XT60-M/AMASS/view-part/?ref=eda
J34 = CMP-02766-001614-1: CONN HEADER VERT 2POS 2MM; Number of Contacts: 2; Gender: Male; Pitch: 2mm; Packaging: Bulk; RoHS Compliant: Yes; Termination: Solder; Contact Plating: Gold; Mount: Through Hole; Number of Rows: 1; Radiation Hardening: No; Lead Free: Lead Free
L1 = SRP5030TA-100M: 10 uH Inductor; Manufacturer_Name: Bourns; Datasheet Link: https://www.bourns.com/docs/Product-Datasheets/SRP5030TA.pdf; Height: 3mm; Manufacturer_Part_Number: SRP5030TA-100M; Mouser Part Number: 652-SRP5030TA-100M; Mouser Price/Stock: https://www.mouser.co.uk/ProductDetail/Bourns/SRP5030TA-100M?qs=ZwKJWZfDtNjU%2FL6UrUlO%2Fw%3D%3D; Arrow Part Number: SRP5030TA-100M; Arrow Price/Stock: https://www.arrow.com/en/products/srp5030ta-100m/bourns?utm_currency=USD&region=nac
L2 = SRP5030TA-6R8M: 6.8uH Inductor; Manufacturer_Name: Bourns; Datasheet Link: https://www.bourns.com/docs/Product-Datasheets/SRP5030TA.pdf; Height: 3mm; Manufacturer_Part_Number: SRP5030TA-6R8M; Mouser Part Number: 652-SRP5030TA-6R8M; Mouser Price/Stock: https://www.mouser.co.uk/ProductDetail/Bourns/SRP5030TA-6R8M?qs=ZwKJWZfDtNjq9Vu0UutxmQ%3D%3D; Arrow Part Number: SRP5030TA-6R8M; Arrow Price/Stock: https://www.arrow.com/en/products/srp5030ta-6r8m/bourns?utm_currency=USD&region=nac; Supplier 1: DigiKey; Supplier Part Number 1: SRP5030TA-6R8MCT-ND
MD1 = CMP-157412-000001-1: TEENSY 4.1 (HEADERS)
NT1 = Net Tie: Use to tie together nets
Q1-Q24 = CMP-12801-000029-1: MOSFET P-CH 20V 600MA SOT23-3; Manufacturer: Diodes Inc.; Max Junction Temp: +150°C; Turn On Delay Time: 8.5ns; Gate To Source Voltage: 8V; Input Capacitace At Vds: 175pF @ -16V; Rthja Max: 227°C/W; Drain To Source Resistance: 1.1Ω; Turn Off Delay Time: 20.2ns; Standoff Height: 0.013mm; Drain To Source Breakdown Voltage: -20V; Number Of P Channels: 1; Power Dissipation: 550mW; Pulse Drain Current: -1.9A; Depletion Mode: False; Max Forward Diode Voltage: -1.2V; Threshold Vgs Min: -0.5V; Threshold Vgs Max: -1V; Continuous Drain Current: -600mA; Manufacturer Part Number: DMP2004K-7; Height: 1.1mm; ComponentLink2Description: Datasheet; ComponentLink2URL: https://www.diodes.com/assets/Datasheets/ds30933.pdf; Package: SOT23; Footprint Url: https://www.diodes.com/assets/Package-Files/SOT23.pdf; Lead Free: Yes; Octopart: https://octopart.com/dmp2004k-7-diodes+inc.-7151877; Digikey Description: MOSFET P-CH 20V 600MA SOT23-3; Device Class L1: Discrete Semiconductors; Drain To Source Voltage: -20V; Mouser Description: MOSFET P-Channel; Number Of Channels: 1; Device Class L3: MOSFETs; Temperature: -55°C to +150°C; Category: Trans; Device Class L2: Transistors; Automotive: No; Temperature Range High: +150°C; RoHS: TRUE; Temperature Range Low: -55°C
R1-R10 R12-R16 R20-R33 = Resistor: TC1: 0; SimulationGenericComponent: True; TC2: 0
R11 = RT0603BRE0751KL: RES 51K 0.1% SM0603 YAGEO RC_L; Manufacturer Part Number: RC0603FR-071KL; Power (Watts): 0.1; Resistance (Ohms): 1000; Tolerance (%): 1; Value: 1K; Category: Resistor; Manufacturer: Yageo; Package: 0603; ComponentLink1URL: http://www.yageo.com; ComponentLink1Description: Manufacturer Website; Supplier 1: Digikey; Supplier Part Number 1: YAG4750CT-ND
R17 = RC0603FR-0788K7L: RES 88K7 SM0603 YAGEO RC_L; Manufacturer Part Number: RC0603FR-0782KL; Power (Watts): 0.1; Resistance (Ohms): 82000; Tolerance (%): 1; Category: Resistor; Manufacturer: Yageo; Package: 0603; Value: 88K7; Supplier Part Number 1: 9238719; Supplier 1: Farnell; ComponentLink1URL: http://www.yageo.com; ComponentLink1Description: Manufacturer Website; Supplier 2: Digi-Key; Supplier Part Number 2: 311-82.0KHRCT-ND
R18 = RC0603FR-0722K1L: RES 22K1 SM0603 YAGEO RC_L; Manufacturer Part Number: RC0603FR-0722KL; Power (Watts): 0.1; Resistance (Ohms): 22000; Tolerance (%): 1; Category: Resistor; Manufacturer: Yageo; Package: 0603; Value: 22K1; Supplier Part Number 1: 9238646; Supplier 1: Farnell; ComponentLink1URL: http://www.yageo.com; ComponentLink1Description: Manufacturer Website; Supplier 2: Digi-Key; Supplier Part Number 2: 311-22.0KHRCT-ND
R19 = RT0603BRD0722K1L: RES 22K1 0.1% SM0603 YAGEO RC_L; Manufacturer Part Number: RC0603FR-071KL; Power (Watts): 0.1; Resistance (Ohms): 1000; Tolerance (%): 1; Value: 1K; Category: Resistor; Manufacturer: Yageo; Package: 0603; ComponentLink1URL: http://www.yageo.com; ComponentLink1Description: Manufacturer Website; Supplier 1: Digikey; Supplier Part Number 1: YAG1590CT-ND
U1 U9 = LMR23630-Q1: Buck Converter; Manufacturer 1: Texas Instruments; Manufacturer Part Number 1: LMR23630AFQDDARQ1; Supplier 1: Digi-Key; Supplier Part Number 1: 296-45260-1-ND; Stock 1: 2872; Pricing 1: 1=3.97, 10=3.564, 100=2.9204, 500=2.486, 1000=2.0967 (USD); Min Operating Temperature: -40°C; Max Operating Temperature: 125°C
U7 U8 U10 = CMP-14351-000006-1: IC SHIFT REGISTER 8BIT 16SOIC; RoHS Compliant: Yes
U11-U17 U19-U24 U28-U39 = OpAmp with power terminals: SimulationGenericComponent: True
U18 U26 U27 = CMP-0188-00351-3: IC ADC 10BIT SAR 16SOIC; Resolution: 10b; Output Voltage: 4.1V; Number of Channels: 8; Number of Elements: 1; Number of Bits: 10; Full Scale Error: 1LSB; Signal to Noise Ratio (SNR): 200dB; Interface: SPI; Nominal Supply Current: 425uA; Sampling Rate: 200KS/s; Supply Type: Single; Min Supply Voltage: 2.7V; Max Supply Voltage: 5.5V; Operating Supply Voltage: 5V; Polarity: Unipolar; Min Operating Temperature: -40°C; REACH SVHC: No SVHC; Integral Nonlinearity (INL): 1LSB; Mount: Surface Mount; Number of Converters: 1; Differential Nonlinearity: 1LSB; Contact Plating: Tin; Lead Free: Lead Free; Conversion Rate: 200KS/s; Radiation Hardening: No; Max Operating Temperature: 85°C; Case/Package: SOIC; Package Quantity: 2600; Number of Pins: 16; Packaging: Tape and Reel; Number of A/D Converters: 1